# EAGLE design P08R7 (EAGLE 9.6.1)

## Sheet 1 of 2
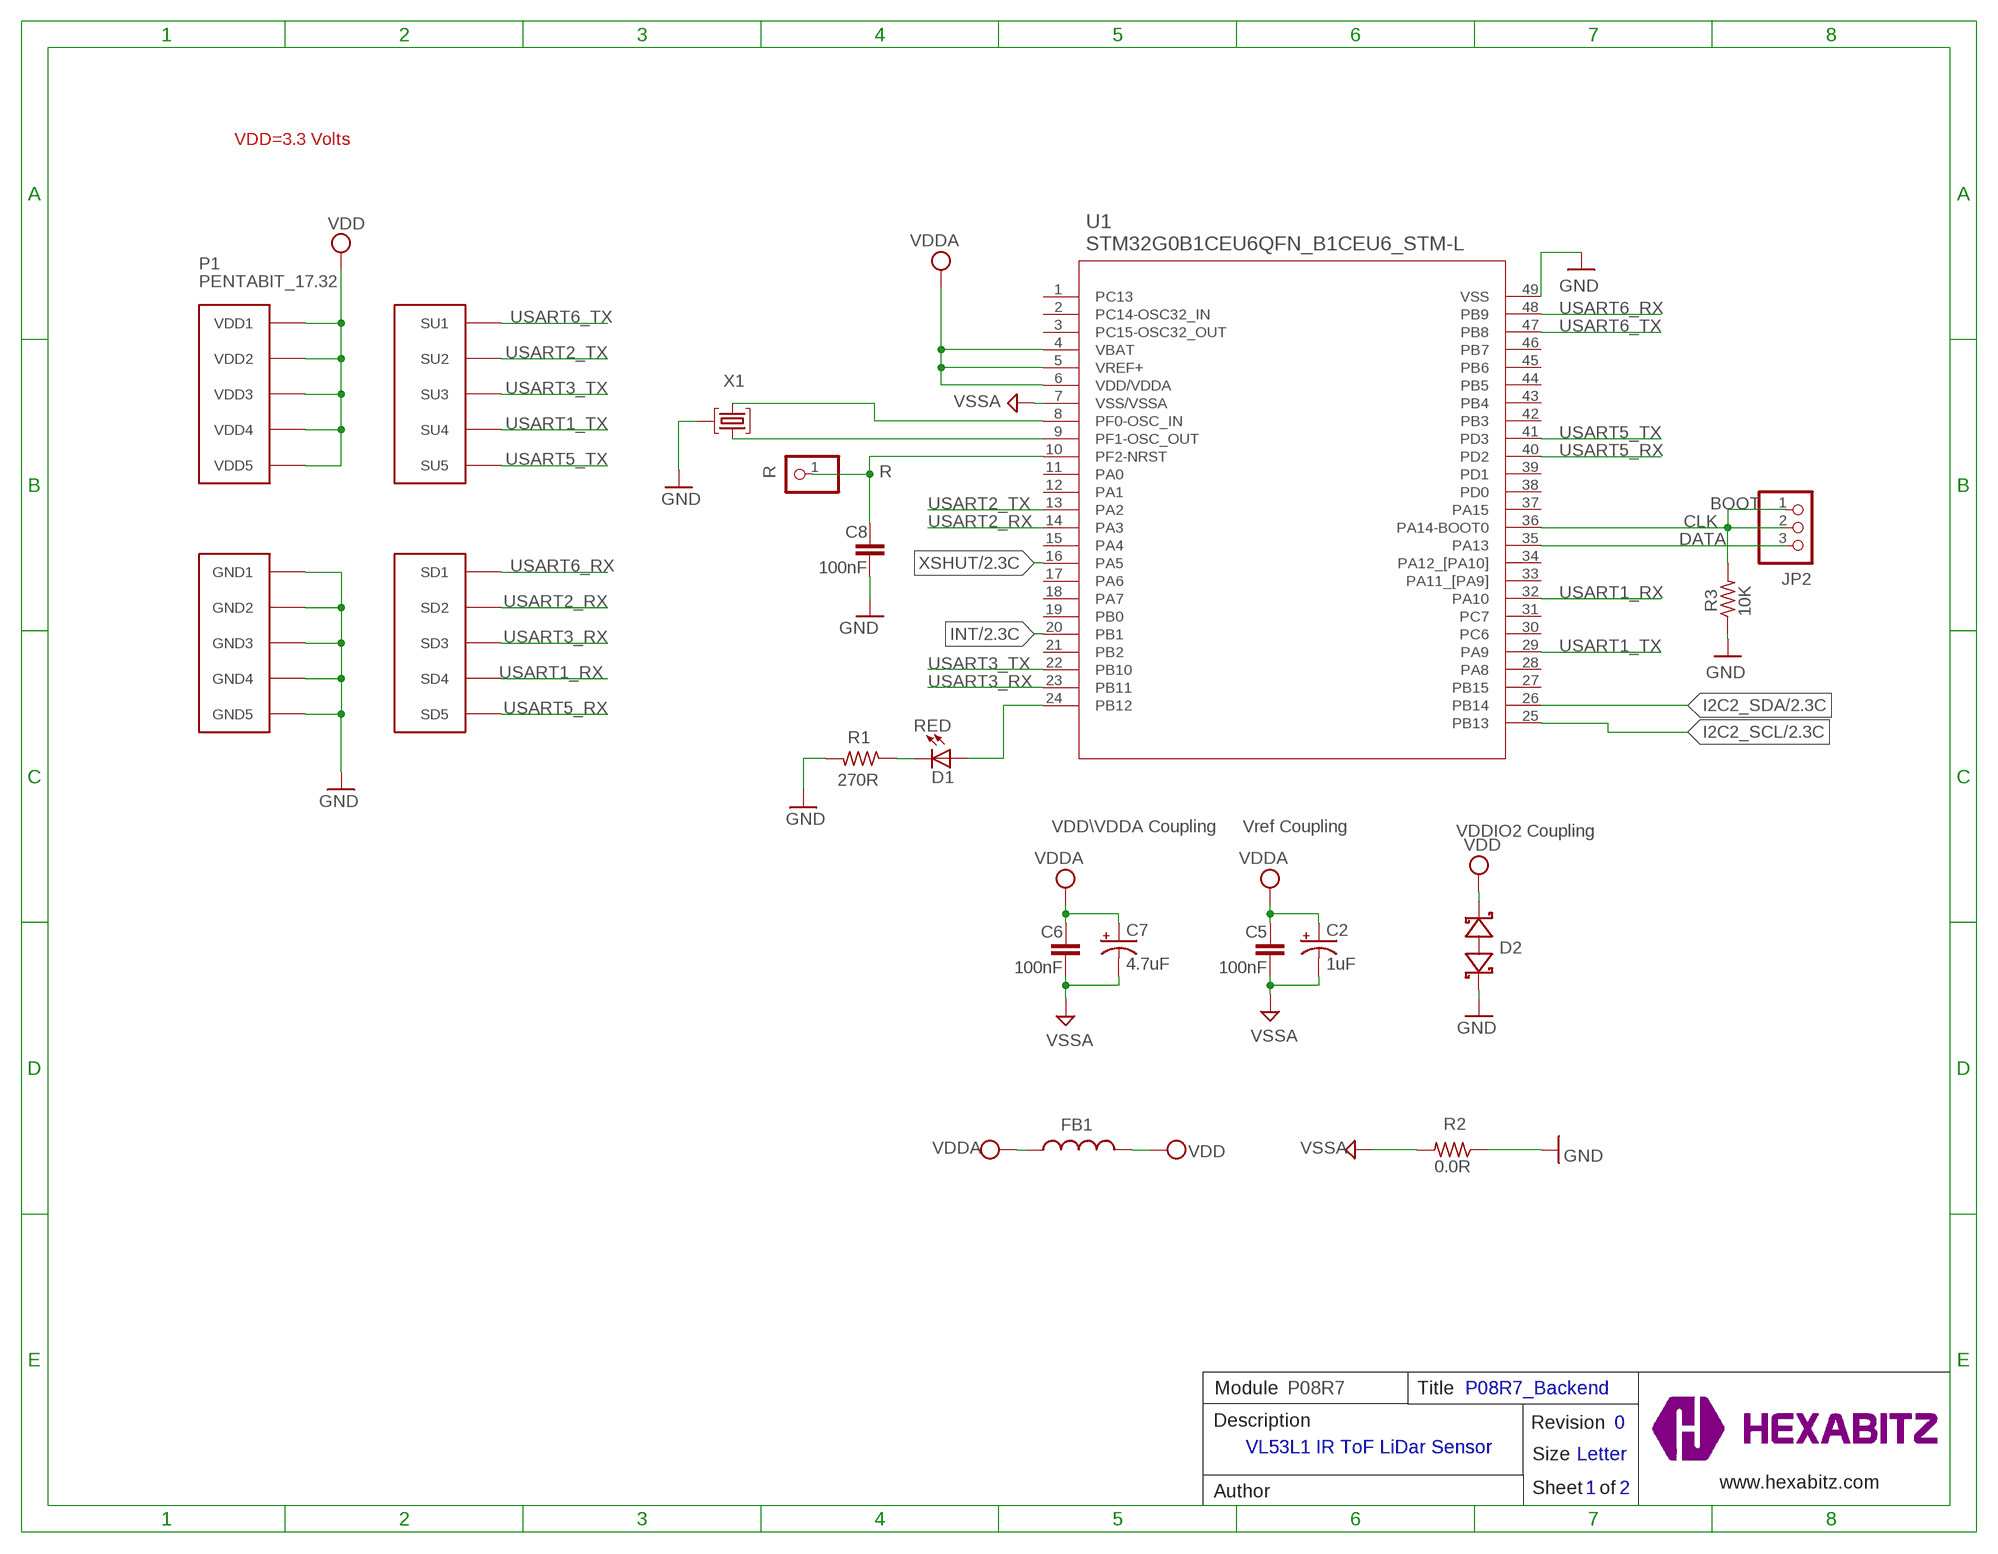
[diagram p0: schematic, sheet 1]

### Parts
C2  1uF  C-0805-POL  [C-0805-POL]
C5  100nF  C-0603  [C-0603]
C6  100nF  C-0603  [C-0603]
C7  4.7uF  C-0805-POL  [C-0805-POL]
C8  100nF  C-0603  [C-0603]
D1  RED  VLMS1300-GS08  [VLMS1300-GS08]
D2  BOURNS_CDSOD323-T03SCBOURNS_CDSOD323-T03SC_0_0  [BOURNS_CDSOD323-T03SC_0]
FB1  FB-TDK_MMZ1608Y300B  [FB-TDK_MMZ1608Y300B]
JP2  PINHD-1X3  [1X03]
P1  PENTABIT_17.32  [PENTABIT_17.32]
R  R  PINHD-1X1  [1X01]
R1  270R  R-0603  [R-0603]
R2  0.0R  R-0603  [R-0603]
R3  10K  R-0603  [R-0603]
TRIMBLE-LOGO1  HEXA-LOGO  [HEXA-LOGO]
U1  STM32G0B1CEU6QFN_B1CEU6_STM-L  [QFN_B1CEU6_STM-L]
X1  XTALL_CSTCE8M00G52  [XTALL_CSTCE8M00G52]

### Nets
CLK: JP2.1 JP2.2 R3.2 U1.36(PA14-BOOT0)
DATA: JP2.3 U1.35(PA13)
GND: C8.2 D2.1(A) P1.PAD_PD6(GND1) P1.PAD_PD7(GND2) P1.PAD_PD8(GND3) P1.PAD_PD9(GND4) P1.PAD_PD10(GND5) R1.2 R2.1 R3.1 U1.49(VSS) X1.P$2 ; also sheet 2
I2C2_SCL: U1.25(PB13) ; also sheet 2
I2C2_SDA: U1.26(PB14) ; also sheet 2
INT: U1.20(PB1) ; also sheet 2
N$1: D1.C R1.1
N$2: D1.A U1.24(PB12)
N$4: C8.1 R.1 U1.10(PF2-NRST)
N$5: U1.9(PF1-OSC_OUT) X1.P$1
N$6: U1.8(PF0-OSC_IN) X1.P$3
USART1_RX: P1.PAD_PD4(SD4) U1.32(PA10)
USART1_TX: P1.PAD_PU4(SU4) U1.29(PA9)
USART2_RX: P1.PAD_PD2(SD2) U1.14(PA3)
USART2_TX: P1.PAD_PU2(SU2) U1.13(PA2)
USART3_RX: P1.PAD_PD3(SD3) U1.23(PB11)
USART3_TX: P1.PAD_PU3(SU3) U1.22(PB10)
USART5_RX: P1.PAD_PD5(SD5) U1.40(PD2)
USART5_TX: P1.PAD_PU5(SU5) U1.41(PD3)
USART6_RX: P1.PAD_PD1(SD1) U1.48(PB9)
USART6_TX: P1.PAD_PU1(SU1) U1.47(PB8)
VDD: D2.2(C) FB1.2 P1.PAD_PU6(VDD1) P1.PAD_PU7(VDD2) P1.PAD_PU8(VDD3) P1.PAD_PU9(VDD4) P1.PAD_PU10(VDD5) ; also sheet 2
VDDA: C2.1(+) C5.1 C6.1 C7.1(+) FB1.1 U1.4(VBAT) U1.5(VREF+) U1.6(VDD/VDDA)
VSSA: C2.2(-) C5.2 C6.2 C7.2(-) R2.2 U1.7(VSS/VSSA)
XSHUT: U1.16(PA5) ; also sheet 2
Unconnected: U1.1(PC13) U1.2(PC14-OSC32_IN) U1.3(PC15-OSC32_OUT) U1.11(PA0) U1.12(PA1) U1.15(PA4) U1.17(PA6) U1.18(PA7) U1.19(PB0) U1.21(PB2) U1.27(PB15) U1.28(PA8) U1.30(PC6) U1.31(PC7) U1.33(PA11_[PA9]) U1.34(PA12_[PA10]) U1.37(PA15) U1.38(PD0) U1.39(PD1) U1.42(PB3) U1.43(PB4) U1.44(PB5) U1.45(PB6) U1.46(PB7)

### Notes on the sheet
- VDD=3.3 Volts
- BOOT
- VDD\VDDA Coupling | Vref Coupling | VDDIO2 Coupling
- Module | P08R7 | Title | P08R7_Backend
- Description | Revision | 0
- VL53L1 IR ToF LiDar Sensor
- Size | Letter
- www.hexabitz.com
- Author | Sheet   of | 1 | 2
- C:/Users/Admin/Desktop/logodraft.bmp

## Sheet 2 of 2
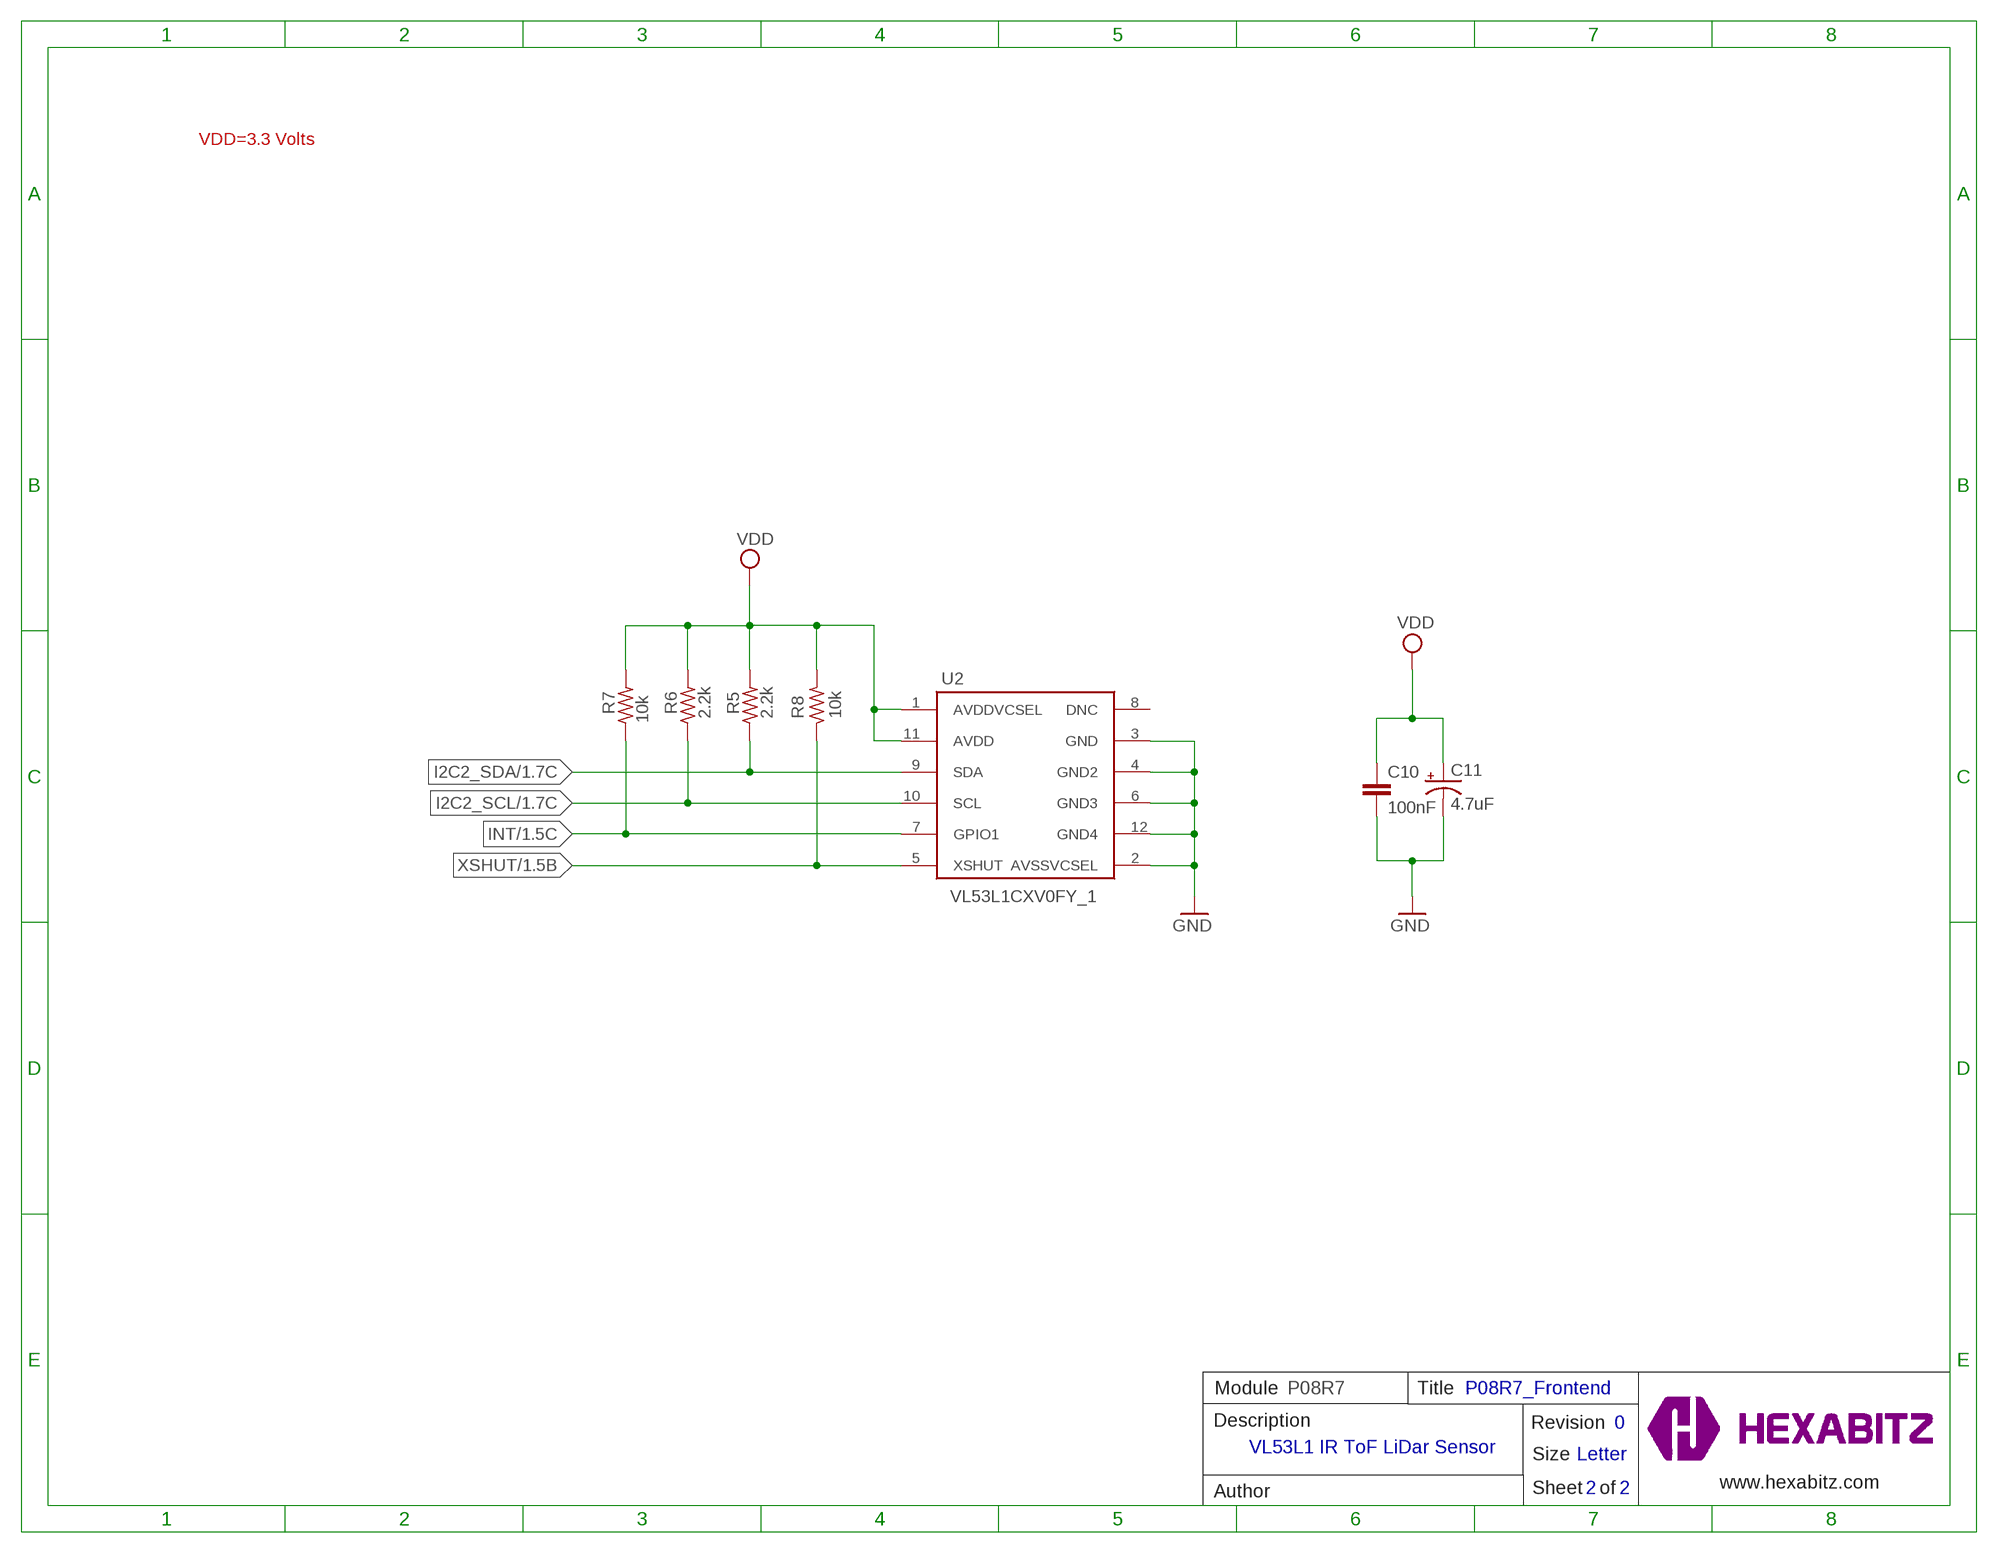
[diagram p1: schematic, sheet 2]

### Parts
C10  100nF  C-0603  [C-0603]
C11  4.7uF  C-0805-POL  [C-0805-POL]
R5  2.2k  R-0603  [R-0603]
R6  2.2k  R-0603  [R-0603]
R7  10k  R-0603  [R-0603]
R8  10k  R-0603  [R-0603]
U2  VL53L1CXV0FY_1  [VL53L1CXV0FY1]

### Nets
GND: C10.2 C11.2(-) U2.2(AVSSVCSEL) U2.3(GND) U2.4(GND2) U2.6(GND3) U2.12(GND4) ; also sheet 1
I2C2_SCL: R6.1 U2.10(SCL) ; also sheet 1
I2C2_SDA: R5.1 U2.9(SDA) ; also sheet 1
INT: R7.1 U2.7(GPIO1) ; also sheet 1
VDD: C10.1 C11.1(+) R5.2 R6.2 R7.2 R8.2 U2.1(AVDDVCSEL) U2.11(AVDD) ; also sheet 1
XSHUT: R8.1 U2.5(XSHUT) ; also sheet 1
Unconnected: U2.8(DNC)

### Notes on the sheet
- VDD=3.3 Volts
- Module | P08R7 | Title | P08R7_Frontend
- Description | Revision | 0
- VL53L1 IR ToF LiDar Sensor
- Size | Letter
- www.hexabitz.com
- Author | Sheet   of | 2 | 2

## Library data of the parts
C2 C7 C11 = HEXABITZ_RCLS:C-0805-POL: Cap Tant Solid SMD 2012
C5 C6 C8 C10 = HEXABITZ_RCLS:C-0603: CAP CER 10% X7R 0603
D1 = Hexabitz:VLMS1300-GS08: Red 0603 130° Clear 54 mcd 2 V Surface Mount ChipLED ; Octopart Url : http://octopart.com/vlms1300-gs08-vishay-21709201; MFN: Vishay; MPN: VLMS1300-GS08; OCTOPART_URL: https://octopart.com/vlms1300-gs08-vishay-21709201?r=sp&s=_gcP4_q8T1SC6PJQPTQ9yA
D2 = HEXABITZ_RCLS:BOURNS_CDSOD323-T03SC: CDSOD323-TxxSC - TVS Diode Series; DESCRIPTION: Dio Tvs Vwm 03V 500W Bidir Sod323 / Tape & Reel - 7" Reel; MFN: Bourns; MPN: CDSOD323-T03SC; OCTOPART_URL: https://octopart.com/cdsod323-t03sc-bourns-10487153?r=sp
FB1 = HEXABITZ_RCLS:FB-TDK_MMZ1608Y300B: Ferrite Beads Multi-Layer 30Ohm 25% 100MHz 1.5A 50mOhm DCR 0603; MFN: TDK; MPN: MMZ1608Y300B; OCTOPART_URL: https://octopart.com/mmz1608y300b-tdk-368280?r=sp&s=cd9_2ZEqQ9q9UNBuQgHAiA
JP2 = pinhead:PINHD-1X3: PIN HEADER
P1 = hexabitz_connectors:PENTABIT_?: Hexabitz Pentagon Module Connector Pentagon side length = 17.32mm.
R = HEXABITZ_USER_INTERFACE_PARTS:PINHD-1X1: PIN HEADER; MFN: TE Connectivity; MPN: 87227-1; OCTOPART_URL: https://octopart.com/87227-1-te+connectivity-39512052?r=sp
R1 R3 R5-R8 = HEXABITZ_RCLS:R-0603: Thick Film Resistors - SMD 0603
R2 = HEXABITZ_RCLS:R-0603: Thick Film Resistors - SMD 0603; MFN: Yageo; MPN: RC0603JR-070RL; OCTOPART_URL: https://octopart.com/rc0603jr-070rl-yageo-1241539?r=sp&s=X2NteqRjRNWrnx42Y0aliA; RESISTANCE: 0.0 Ohm
TRIMBLE-LOGO1 = HEXABITZ_USER_INTERFACE_PARTS:HEXA-LOGO: Trimble-Logo
U1 = HEXABITZ_ICs:STM32G0B1CEU6; COPYRIGHT: Copyright (C) 2021 Ultra Librarian. All rights reserved.; MANUFACTURER_PART_NUMBER: STM32G0B1CEU6; MFR_NAME: STMicroelectronics
U2 = HEXABITZ_ICs:VL53L1CXV0FY_1: Long distance ranging Time-of-Flight sen Source: Datasheet <https://componentsearchengine.com/Datasheets/1/VL53L1CXV0FY_1.pdf>; DESCRIPTION: Long distance ranging Time-of-Flight sen; HEIGHT: 1mm; MANUFACTURER_NAME: STMicroelectronics; MANUFACTURER_PART_NUMBER: VL53L1CXV0FY/1; MOUSER_PART_NUMBER: 511-VL53L1CXV0FY/1; MOUSER_PRICE-STOCK: https://www.mouser.co.uk/ProductDetail/STMicroelectronics/VL53L1CXV0FY-1?qs=W0yvOO0ixfFQE5v5L6h6PA%3D%3D
X1 = Hexabitz:XTALL_CSTCE8M00G52: MURATA CSTCE8M00G52-R0 RESONATOR, SMD, 8MHZ ; Octopart Url : https://octopart.com/cstce8m00g52-r0-murata-7145559; MFN: Murata; MPN: CSTCE8M00G52Z-R0; OCTOPART_URL: https://octopart.com/cstce8m00g52z-r0-murata-17755941?r=sp&s=JDnNJnrHQhyS8Zk4ofFWXw

## Board
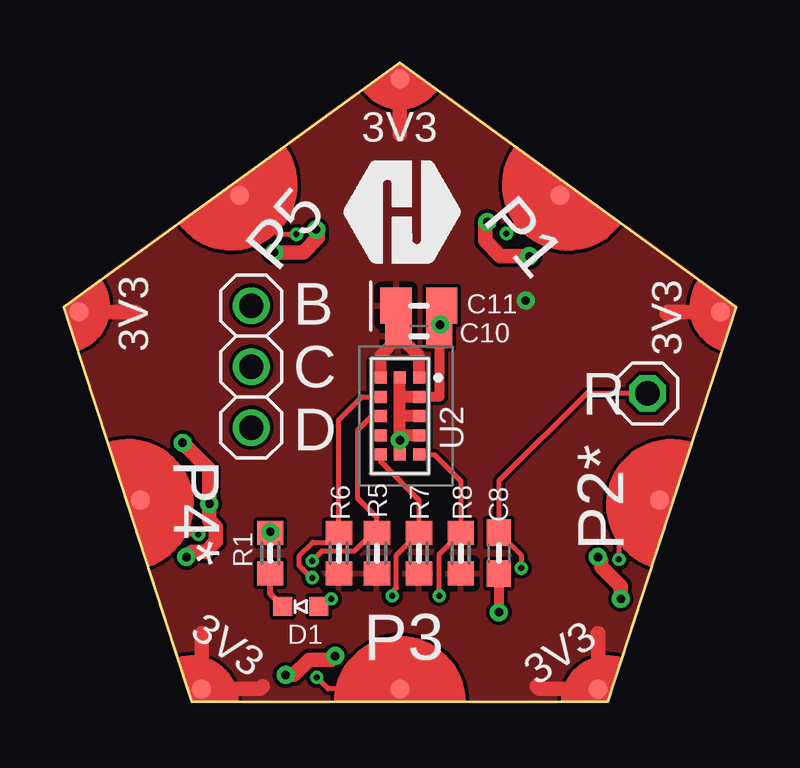
[diagram p2: board, top side]
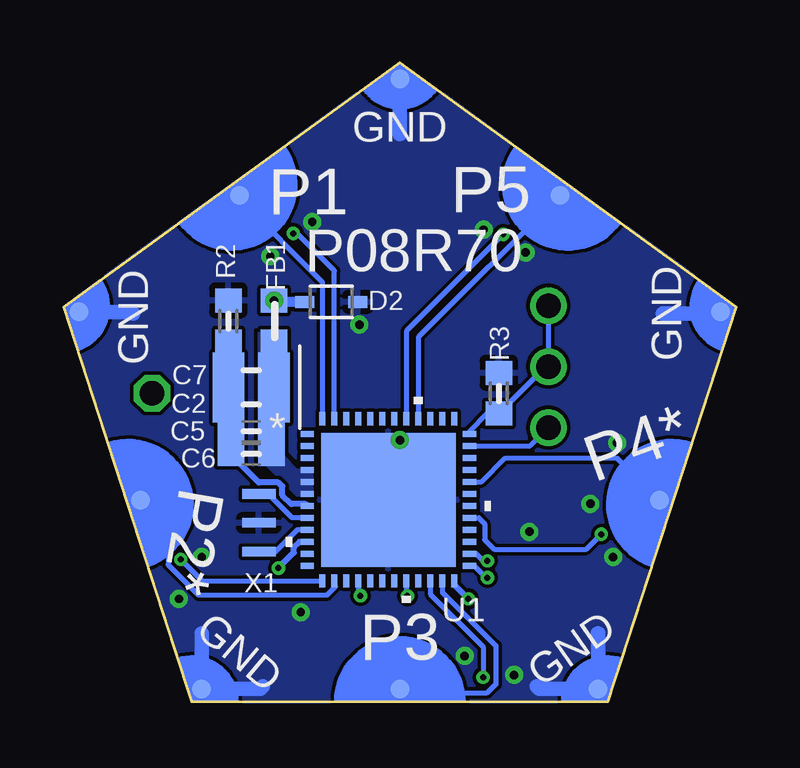
[diagram p3: board, bottom side, seen from below]

Size 28.02 x 26.65 mm. Coordinates in mm from the lower left corner, seen from the top.
Copper layers (1*16): Top 0.035mm / dielectric 1.5mm / Bottom 0.035mm
Design rules "default *": minimum track width 6mil, minimum drill 0.25mm, track to track 6mil, track to pad 6mil, pad to pad 6mil, via to via 6mil, smd to smd 0mil, copper to edge 0mil, drill to drill 1mil, minimum pad ring 10mil, minimum via ring 6mil, stop-mask expansion 4mil, vias tented up to drill 25mil, thermal gap 10mil

### Footprints (pad centres in the part's own frame; a part is rotated, then mirrored left to right if it is on the bottom)
C-0805-POL = smd 1.3 x 1.5: 1 -0.95,0; 2 0.95,0
C-0603 = smd 1.1 x 1: 1 -0.85,0; 2 0.85,0
VLMS1300-GS08 = smd 0.8 x 0.8: A 0,0.75; C 0,-0.75
BOURNS_CDSOD323-T03SC_0 = smd 0.8 x 0.5: 1 -1.1,0; 2 1.1,0
FB-TDK_MMZ1608Y300B = smd 1 x 1.1: 1 -0.85,0; 2 0.85,0
1X03 = drill 1.016: 1 -2.54,0; 2 0,0; 3 2.54,0
PENTABIT_17.32 = smd 0.8 x 0.8 bottom: PAD_PD1 6.68,9.2; PAD_PD2 10.81,-3.51; PAD_PD3 0,-11.37; PAD_PD4 -10.81,-3.51; PAD_PD5 -6.68,9.2; PAD_PD6 0,14.05; PAD_PD7 13.36,4.34; PAD_PD8 8.26,-11.37; PAD_PD9 -8.26,-11.37; PAD_PD10 -13.36,4.34 | smd 0.8 x 0.8: PAD_PU1 6.68,9.2; PAD_PU2 10.81,-3.51; PAD_PU3 0,-11.37; PAD_PU4 -10.81,-3.51; PAD_PU5 -6.68,9.2; PAD_PU6 0,14.05; PAD_PU7 13.36,4.34; PAD_PU8 8.26,-11.37; PAD_PU9 -8.26,-11.37; PAD_PU10 -13.36,4.34
1X01 = drill 1.016 octagon: 1 0,0
R-0603 = smd 1 x 1.1: 1 -0.85,0; 2 0.85,0
QFN_B1CEU6_STM-L = smd 0.55 x 0.254: 1 -3.38,2.751; 2 -3.38,2.251; 3 -3.38,1.75; 4 -3.38,1.25; 5 -3.38,0.75; 6 -3.38,0.25; 7 -3.38,-0.25; 8 -3.38,-0.75; 9 -3.38,-1.25; 10 -3.38,-1.75; 11 -3.38,-2.251; 12 -3.38,-2.751; 25 3.38,-2.751; 26 3.38,-2.251; 27 3.38,-1.75; 28 3.38,-1.25; 29 3.38,-0.75; 30 3.38,-0.25; 31 3.38,0.25; 32 3.38,0.75; 33 3.38,1.25; 34 3.38,1.75; 35 3.38,2.251; 36 3.38,2.751 | smd 0.254 x 0.55: 13 -2.751,-3.38; 14 -2.251,-3.38; 15 -1.75,-3.38; 16 -1.25,-3.38; 17 -0.75,-3.38; 18 -0.25,-3.38; 19 0.25,-3.38; 20 0.75,-3.38; 21 1.25,-3.38; 22 1.75,-3.38; 23 2.251,-3.38; 24 2.751,-3.38; 37 2.751,3.38; 38 2.251,3.38; 39 1.75,3.38; 40 1.25,3.38; 41 0.75,3.38; 42 0.25,3.38; 43 -0.25,3.38; 44 -0.75,3.38; 45 -1.25,3.38; 46 -1.75,3.38; 47 -2.251,3.38; 48 -2.751,3.38 | smd 5.6 x 5.6: 49 0,0
VL53L1CXV0FY1 = smd 0.5 x 0.5: 1 -1.6,0.8; 2 -0.8,0.8; 3 0,0.8; 4 0.8,0.8; 5 1.6,0.8; 6 1.6,0; 7 1.6,-0.8; 8 0.8,-0.8; 9 0,-0.8; 10 -0.8,-0.8; 11 -1.6,-0.8; 12 -1.6,0
XTALL_CSTCE8M00G52 = smd 1.4 x 0.4: P$1 0,1.2; P$2 0,0; P$3 0,-1.2

### Placement (x,y rotation side)
C2  20.2,12.4 180 bottom
C5  20.2,11.29 180 bottom
C6  20.2,10.33 180 bottom
C7  20.2,13.82 180 bottom
C8  18.14,6.21 270 top
C10  14.8,15.25 0 top
C11  14.8,16.52 0 top
D1  9.88,3.98 270 top
D2  16.87,16.68 180 bottom
FB1  19.25,15.89 90 bottom
JP2  7.82,13.98 270 top
P1  14.01,11.92 0 top
R  24.33,12.87 0 top
R1  8.61,6.21 90 top
R2  21.15,15.89 270 bottom
R3  9.88,12.87 270 bottom
R5  13.06,6.21 270 top
R6  11.47,6.21 270 top
R7  14.8,6.21 270 top
R8  16.55,6.21 270 top
TRIMBLE-LOGO1  14.17,18.27 0 top
U1  14.49,8.43 0 bottom
U2  14.01,11.92 270 top
X1  19.88,7.47 180 bottom

### Tracks (layer width: path | path; a pad name or v marks a point on that pad's centre or on a via)
CLK
  Bottom 0.203: JP2.1 JP2.2 7.92,13.98 R3.2 10.36,12.02 11.11,11.28 U1.36
DATA
  Bottom 0.203: JP2.3 8.58,10.68 U1.35
GND  (via drill 0.35 pad 0.75)
  Top 0.254: R1.2 8.98,7.42
  Top 0.406: U2.2 15.65,12.72 C10.2 v15.69,15.73 15.75,15.73 C11.2 | 14.01,11.13 v14.01,10.92 | C8.2 v18.14,3.74
  Top 0.508: U2.6 v14.01,10.92 | 14.01,11.92 14.01,11.13 14.02,11.12 U2.4 | 14.01,11.92 14.01,12.71 | 14.01,12.71 U2.12 | U2.3 14.01,11.92 | U2.2 14.02,12.72 14.01,12.71
  Top 0.61: v11.31,1.92 11.16,1.77 10.24,1.77 9.6,1.12 v9.25,1.12 | v22.27,6.05 22.4,5.91 22.4,5.64 23.22,4.83 v23.22,4.3 | v4.96,10.81 6.07,9.7 v6.07,8.27 6.07,7.57 6.35,7.3 6.35,6.69 5.92,6.26 5.33,6.26 v5.12,6.05 | v10.52,19.7 10.59,19.62 10.59,19.36 9.98,18.75 v8.77,18.75 | v17.66,20.02 17.56,19.91 17.56,19.23 18.2,18.59 v19.41,18.59 | R1.2 v8.61,7.1
  Bottom 0.61: 3.06,16.21 0.7,16.21 P1.PAD_PD10 | 5.75,2.87 P1.PAD_PD9 8.2,0.55 8.29,0.65 | 22.27,2.87 P1.PAD_PD8 19.82,0.55 19.73,0.65 | P1.PAD_PD7 25.18,16.26 25.12,16.21 | P1.PAD_PD6 14.01,23.67 | U1.49 14.01,8.9 v14.01,10.92
  pour Bottom (rank 2): 0.04,16.52 14.01,26.68 27.98,16.52 22.58,0.01 5.44,0.01
I2C2_SCL  (via drill 0.25 pad 0.55)
  Top 0.203: v10.36,5.18 10.18,5.36 10.14,5.36 9.83,5.67 9.83,6.11 10.38,6.66 11.07,6.66 R6.1 11.47,11.76 12.43,12.72 U2.10
  Bottom 0.203: v10.36,5.18 10.4,5.18 10.9,5.68 U1.25
I2C2_SDA  (via drill 0.25 pad 0.55)
  Top 0.203: v10.36,5.89 10.77,6.3 12.12,6.3 12.88,7.05 R5.1 13.06,7.69 12.26,8.48 12.26,11.35 12.83,11.92 U2.9
  Bottom 0.203: U1.26 10.82,6.18 10.53,5.89 v10.36,5.89
INT  (via drill 0.25 pad 0.55)
  Top 0.203: v13.69,4.42 13.69,4.58 13.86,4.75 13.86,6.11 R7.1 14.8,8.43 13.21,10.02 U2.7
  Bottom 0.203: U1.20 13.74,4.47 v13.69,4.42
N$1
  Top 0.254: D1.C 8.61,4.5 R1.1
N$2  (via drill 0.25 pad 0.55)
  Top 0.254: D1.A 10.95,4.3 v11.15,4.3
  Bottom 0.254: v11.15,4.3 11.74,4.88 U1.24
N$4  (via drill 0.25 pad 0.55)
  Top 0.203: v19.07,5.58 19.07,6.12 C8.1 18.14,9.22 21.79,12.87 R.1
  Bottom 0.254: v19.07,5.58 18.42,6.23 18.42,6.44 18.18,6.68 U1.10
N$5
  Bottom 0.203: U1.9 18.28,7.18 19.18,6.28 X1.P$1
N$6
  Bottom 0.203: U1.8 18.5,7.68 19.5,8.68 X1.P$3
USART1_RX
  Bottom 0.203: U1.32 10.6,9.18 9.61,10.17 4.96,10.17 P1.PAD_PD4
USART1_TX  (via drill 0.25 pad 0.55)
  Top 0.203: v5.62,6.99 4.62,6.99 P1.PAD_PU4
  Bottom 0.203: U1.29 10.72,7.68 10.48,7.43 10.48,6.76 10.08,6.36 6.24,6.36 v5.62,6.99
USART2_RX
  Bottom 0.203: P1.PAD_PD2 23.67,7.26 23.67,5.73 22.4,4.46 17.04,4.46 16.69,4.81 16.74,4.85 U1.14
USART2_TX  (via drill 0.25 pad 0.55)
  Top 0.203: P1.PAD_PU2 23.14,6.73 v23.14,5.95
  Bottom 0.203: v23.14,5.95 22.24,5.05 U1.13
USART3_RX
  Bottom 0.203: P1.PAD_PD3 13.85,0.39 10.36,0.39 10.01,0.74 10.01,2.35 12.24,4.57 U1.23
USART3_TX  (via drill 0.25 pad 0.55)
  Top 0.203: P1.PAD_PU3 11.03,0.55 v10.54,1.03
  Bottom 0.203: v10.54,1.03 10.54,2.3 12.74,4.49 U1.22
USART5_RX
  Bottom 0.203: P1.PAD_PD5 13.24,15.21 U1.40
USART5_TX  (via drill 0.25 pad 0.55)
  Top 0.203: P1.PAD_PU5 8.95,19.5 v9.7,19.5
  Bottom 0.203: v9.7,19.5 13.74,15.46 U1.41
USART6_RX
  Bottom 0.203: P1.PAD_PD1 20.69,20.96 17.24,17.51 U1.48
USART6_TX  (via drill 0.25 pad 0.55)
  Top 0.203: v18.45,19.54 20.04,21.12 P1.PAD_PU1
  Bottom 0.203: U1.47 16.74,17.98 18.45,19.7 v18.45,19.54
VDD  (via drill 0.35 pad 0.75)
  Top 0.508: U2.11 13.21,14.45 13.95,15.2 C10.1 14.81,14.4 U2.1
  Top 0.61: P1.PAD_PU10 3,16.26 3.06,16.21 | 5.75,2.87 P1.PAD_PU9 8.2,0.55 8.29,0.65 | 22.27,2.87 P1.PAD_PU8 19.82,0.55 19.73,0.65 | P1.PAD_PU7 25.18,16.26 25.12,16.21 | P1.PAD_PU6 14.01,23.67
  Bottom 0.406: D2.2 19.19,16.68 FB1.2
  other vias: 19.25,16.74
  cutout Top: 12.74,14.3 15.12,14.3 15.28,14.14 15.28,9.54 12.9,9.54 12.74,9.7
  pour Top: 0.04,16.52 14.01,26.68 27.98,16.52 22.58,0.01 5.44,0.01
VDDA
  pour Bottom (no thermals): 17.66,8.59 18.3,8.59 19.88,10.17 19.88,15.41 18.93,15.41 18.93,10.33 18.3,9.7 17.66,9.7
VSSA
  Bottom 0.254: U1.7 17.94,8.25 18.53,8.25 18.9,8.62 18.9,8.99 19.07,9.15 19.88,9.15 C6.2 C5.2 21.15,11.38 C2.2 C7.2 R2.2
XSHUT  (via drill 0.25 pad 0.55)
  Top 0.203: v15.65,4.43 15.65,6.16 R8.1 16.55,9.22 15.45,10.32 U2.5
  Bottom 0.203: U1.16 15.74,4.52 v15.65,4.43

### Text on the board
tPlace: 3V3 | P5 | P1 | 3V3 | 3V3 | P2* | P4* | P3 | 3V3 | 3V3
bPlace: GND | P5 | P1 | P08R70 | GND | GND | P4* | P2* | P3 | GND | GND
tNames: B | C | D
bNames: U1